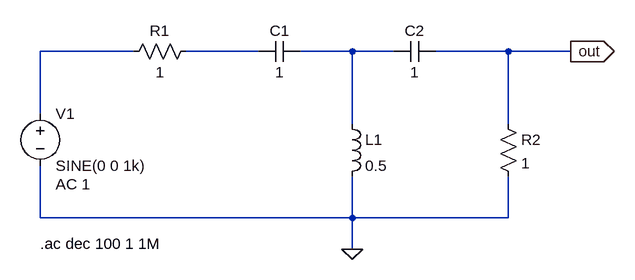
[diagram p0: schematic Part2-2.asc]
Part2-2.asc, the LTspice schematic file:
Version 4.1
SHEET 1 1008 680
WIRE 240 16 96 16
WIRE 432 16 320 16
WIRE 576 16 496 16
WIRE 640 16 576 16
WIRE 816 16 704 16
WIRE 912 16 816 16
WIRE 96 112 96 16
WIRE 576 128 576 16
WIRE 816 128 816 16
WIRE 96 272 96 192
WIRE 576 272 576 208
WIRE 576 272 96 272
WIRE 816 272 816 208
WIRE 816 272 576 272
WIRE 576 320 576 272
FLAG 576 320 0
FLAG 912 16 out
IOPIN 912 16 Out
SYMBOL voltage 96 96 R0
WINDOW 123 24 124 Left 2
WINDOW 39 0 0 Left 0
SYMATTR Value2 AC 1
SYMATTR InstName V1
SYMATTR Value SINE(0 0 1k)
SYMBOL res 336 0 R90
WINDOW 0 0 56 VBottom 2
WINDOW 3 32 56 VTop 2
SYMATTR InstName R1
SYMATTR Value 1
SYMBOL cap 496 0 R90
WINDOW 0 0 32 VBottom 2
WINDOW 3 32 32 VTop 2
SYMATTR InstName C1
SYMATTR Value 1
SYMBOL cap 704 0 R90
WINDOW 0 0 32 VBottom 2
WINDOW 3 32 32 VTop 2
SYMATTR InstName C2
SYMATTR Value 1
SYMBOL ind 560 112 R0
SYMATTR InstName L1
SYMATTR Value 0.5
SYMBOL res 800 112 R0
SYMATTR InstName R2
SYMATTR Value 1
TEXT 96 312 Left 2 !.ac dec 100 1 1M

The netlist it stands for:
* Part2-2.asc
V1 N001 0 SINE(0 0 1k) AC 1
R1 N002 N001 1
C1 N003 N002 1
C2 out N003 1
L1 N003 0 0.5
R2 out 0 1
.ac dec 100 1 1M
.backanno
.end